# Altium schematic sheet USB_SPI.SchDoc: USB_SPI_V2
size A4; Date: 2019/08/25; CheckedBy: A Kadis; Author: DM Dong, YC Wang; CompanyName: CMMPE; Revision: B; SheetNumber: 2; SheetTotal: 4
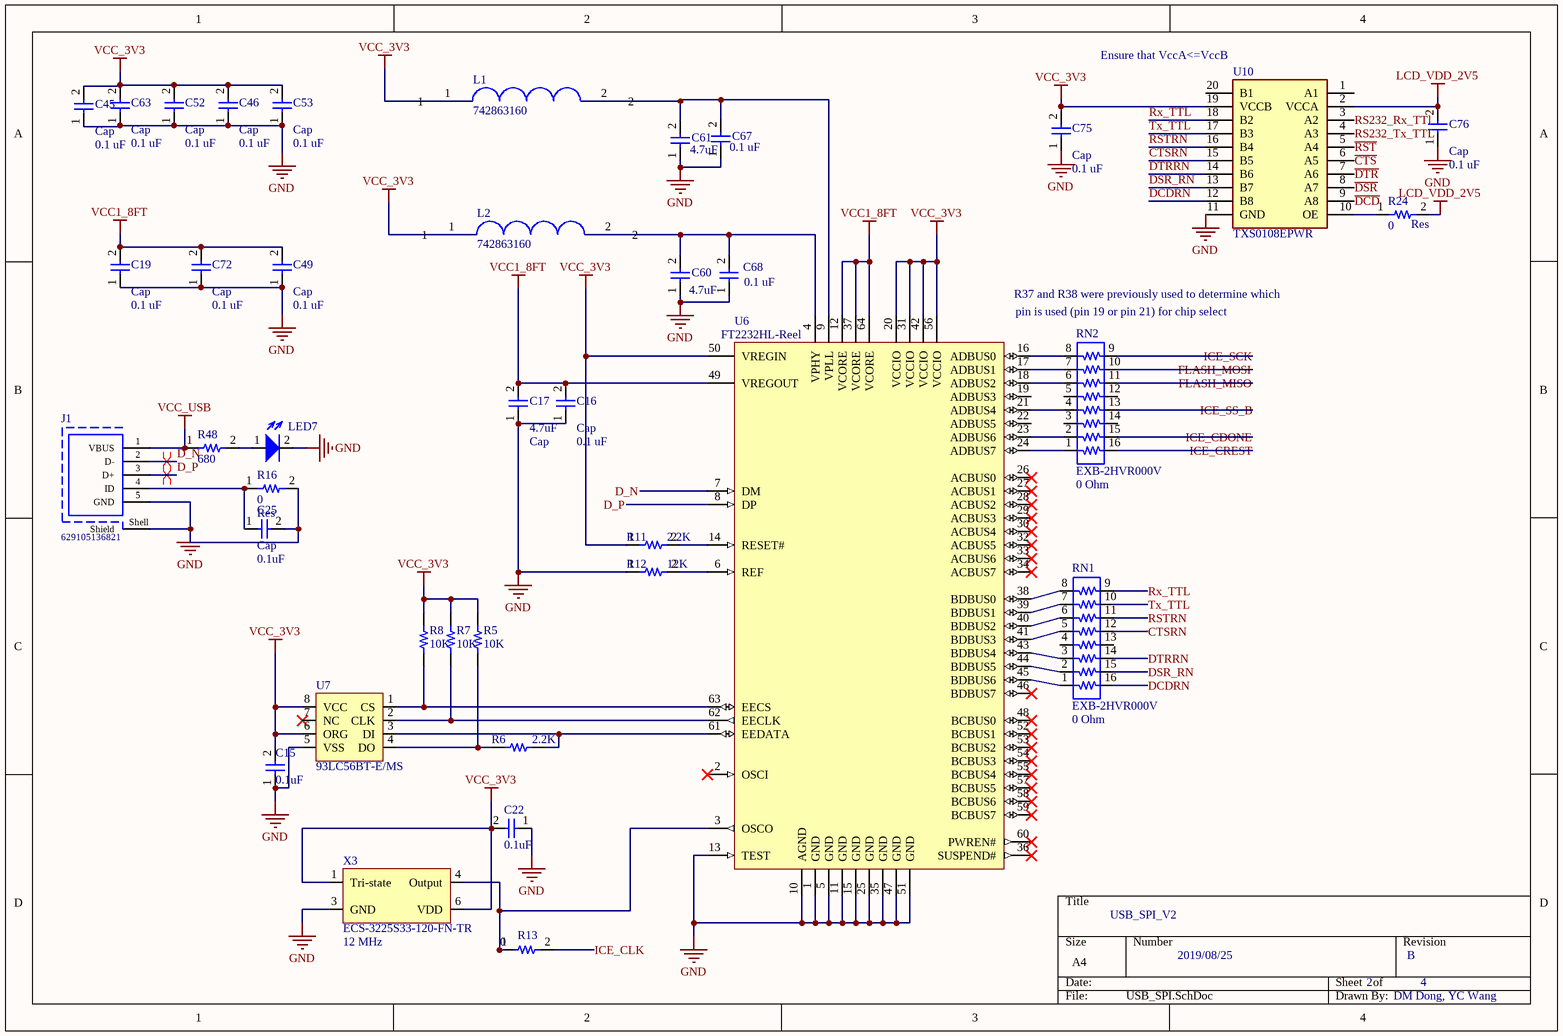
[diagram p0: USB_SPI.SchDoc]

## Parts
C15  value 0.1uF  [Cap_0.1uF]  (hidden comment: AC0603KRX7R9BB104)
C16  value 0.1 uF  Component Name: Cap  [Cap_0.1uF_0402]  (hidden comment: CC0402KPX5R6BB104)
C17  value 4.7uF  Component Name: Cap  [CAP_4.7uF_0402]  (hidden comment: C1005X5R0J475K050BC)
C19  value 0.1 uF  Component Name: Cap  [Cap_0.1uF_0402]  (hidden comment: CC0402KPX5R6BB104)
C22  value 0.1uF  [Cap_0.1uF]  (hidden comment: AC0603KRX7R9BB104)
C25  value 0.1uF  Component Name: Cap  [Cap_0.1uF]  (hidden comment: AC0603KRX7R9BB104)
C45  value 0.1 uF  Component Name: Cap  [Cap_0.1uF_0402]  (hidden comment: CC0402KPX5R6BB104)
C46  value 0.1 uF  Component Name: Cap  [Cap_0.1uF_0402]  (hidden comment: CC0402KPX5R6BB104)
C49  value 0.1 uF  Component Name: Cap  [Cap_0.1uF_0402]  (hidden comment: CC0402KPX5R6BB104)
C52  value 0.1 uF  Component Name: Cap  [Cap_0.1uF_0402]  (hidden comment: CC0402KPX5R6BB104)
C53  value 0.1 uF  Component Name: Cap  [Cap_0.1uF_0402]  (hidden comment: CC0402KPX5R6BB104)
C60  value 4.7uF  [CAP_4.7uF_0402]  (hidden comment: C1005X5R0J475K050BC)
C61  value 4.7uF  [CAP_4.7uF_0402]  (hidden comment: C1005X5R0J475K050BC)
C63  value 0.1 uF  Component Name: Cap  [Cap_0.1uF_0402]  (hidden comment: CC0402KPX5R6BB104)
C67  value 0.1 uF  [Cap_0.1uF_0402]  (hidden comment: CC0402KPX5R6BB104)
C68  value 0.1 uF  [Cap_0.1uF_0402]  (hidden comment: CC0402KPX5R6BB104)
C72  value 0.1 uF  Component Name: Cap  [Cap_0.1uF_0402]  (hidden comment: CC0402KPX5R6BB104)
C75  value 0.1 uF  Component Name: Cap  [Cap_0.1uF_0402]  (hidden comment: CC0402KPX5R6BB104)
C76  value 0.1 uF  Component Name: Cap  [Cap_0.1uF_0402]  (hidden comment: CC0402KPX5R6BB104)
J1  629105136821  [629105136821]
L1  742863160  [FerriteBeads]
L2  742863160  [FerriteBeads]
LED7  TLMS1000-GS08  [LED_RED]  (value not drawn)
R5  value 10K  [RES_10K]  (hidden comment: RT0603WRE0710KL)
R6  value 2.2K  [RES_2.2K]  (hidden comment: CRCW06032K20JNEAC)
R7  value 10K  [RES_10K]  (hidden comment: RT0603WRE0710KL)
R8  value 10K  [RES_10K]  (hidden comment: RT0603WRE0710KL)
R11  value 2.2K  [RES_2.2K]  (hidden comment: CRCW06032K20JNEAC)
R12  value 12K  [RES_12K]  (hidden comment: AC0603FR-1012KL)
R13  value 0  [RES_0]  (hidden comment: CRCW06030000Z0EAC)
R16  value 0  Component Name: Res  [RES_0]  (hidden comment: CRCW06030000Z0EAC)
R24  value 0  Component Name: Res  [RES_0]  (hidden comment: CRCW06030000Z0EAC)
R48  value 680  [RES_680]  (hidden comment: RT0603FRE13680RL)
RN1  EXB-2HVR000V  value 0 Ohm  [ResArray_0]
RN2  EXB-2HVR000V  value 0 Ohm  [ResArray_0]
U6  FT2232HL-Reel  [LQFP-64_N]
U7  93LC56BT-E/MS  [EEPROM]
U10  TXS0108EPWR  [SOP65P640X120-20N]
X3  ECS-3225S33-120-FN-TR  value 12 MHz  [12MHzOscillator]

## Nets
GND: C15.1 C16.1 C17.1 C19.1 C22.1 C25.2 C45.1 C46.1 C49.1 C52.1 C53.1 C60.1 C61.1 C63.1 C67.1 C68.1 C72.1 C75.1 C76.1 J1.5(GND) J1.Shell(Shield) LED7.2(Cathode) R12.1 R16.2 U6.1(GND) U6.5(GND) U6.10(AGND) U6.11(GND) U6.13(TEST) U6.15(GND) U6.25(GND) U6.35(GND) U6.47(GND) U6.51(GND) U7.5(VSS) U10.11(GND) X3.3(GND)
LCD_VDD_2V5: C76.2 R24.2 U10.2(VCCA)
VCC1_8FT: C16.2 C17.2 C19.2 C49.2 C72.2 U6.12(VCORE) U6.37(VCORE) U6.49(VREGOUT) U6.64(VCORE)
VCC_3V3: C15.2 C22.2 C45.2 C46.2 C52.2 C53.2 C63.2 C75.2 L1.1 L2.1 R5.2 R7.2 R8.2 R11.1 U6.20(VCCIO) U6.31(VCCIO) U6.42(VCCIO) U6.50(VREGIN) U6.56(VCCIO) U7.6(ORG) U7.8(VCC) U10.19(VCCB) X3.1(Tri-state) X3.6(VDD)
VCC_USB: J1.1(VBUS) R48.1
~{CTS}: U10.6(A5)
CTSRN: RN1.12 U10.15(B5)
~{DCD}: U10.9(A8)
~{DSR}: U10.8(A7)
~{DTR}: U10.7(A6)
D_N: J1.2(D-) U6.7(DM)
D_P: J1.3(D+) U6.8(DP)
DCDRN: RN1.16 U10.12(B8)
DSR_RN: RN1.15 U10.13(B7)
DTRRN: RN1.14 U10.14(B6)
FLASH_MISO: RN2.11
FLASH_MOSI: RN2.10
ICE_CDONE: RN2.15
ICE_CLK: R13.2
ICE_CREST: RN2.16
ICE_SCK: RN2.9
ICE_SS_B: RN2.13
~{RST}: U10.5(A4)
RS232_Rx_TTl: U10.3(A2)
RS232_Tx_TTL: U10.4(A3)
RSTRN: RN1.11 U10.16(B4)
Rx_TTL: RN1.9 U10.18(B2)
Tx_TTL: RN1.10 U10.17(B3)
NetC25_1: C25.1 J1.4(ID) R16.1
NetC60_2: C60.2 C68.2 L2.2 U6.4(VPHY)
NetC61_2: C61.2 C67.2 L1.2 U6.9(VPLL)
NetLED7_1: LED7.1(Anode) R48.2
NetR5_1: R5.1 R6.1 U7.4(DO)
NetR6_2: R6.2 U6.61(EEDATA) U7.3(DI)
NetR7_1: R7.1 U6.62(EECLK) U7.2(CLK)
NetR8_1: R8.1 U6.63(EECS) U7.1(CS)
NetR11_2: R11.2 U6.14(RESET#)
NetR12_2: R12.2 U6.6(REF)
NetR13_1: R13.1 U6.3(OSCO) X3.4(Output)
NetR24_1: R24.1 U10.10(OE)
NetRN1_1: RN1.1 U6.45(BDBUS6)
NetRN1_2: RN1.2 U6.44(BDBUS5)
NetRN1_3: RN1.3 U6.43(BDBUS4)
NetRN1_5: RN1.5 U6.41(BDBUS3)
NetRN1_6: RN1.6 U6.40(BDBUS2)
NetRN1_7: RN1.7 U6.39(BDBUS1)
NetRN1_8: RN1.8 U6.38(BDBUS0)
NetRN2_1: RN2.1 U6.24(ADBUS7)
NetRN2_2: RN2.2 U6.23(ADBUS6)
NetRN2_4: RN2.4 U6.21(ADBUS4)
NetRN2_6: RN2.6 U6.18(ADBUS2)
NetRN2_7: RN2.7 U6.17(ADBUS1)
NetRN2_8: RN2.8 U6.16(ADBUS0)

Not connected (* = marked no-connect by the designer): RN1 4 13; RN2 3 5 12 14; U6 2(OSCI)* 19(ADBUS3) 22(ADBUS5) 26(ACBUS0)* 27(ACBUS1)* 28(ACBUS2)* 29(ACBUS3)* 30(ACBUS4)* 32(ACBUS5)* 33(ACBUS6)* 34(ACBUS7)* 36(SUSPEND#)* 46(BDBUS7)* 48(BCBUS0)* 52(BCBUS1)* 53(BCBUS2)* 54(BCBUS3)* 55(BCBUS4)* 57(BCBUS5)* 58(BCBUS6)* 59(BCBUS7)* 60(PWREN#)*; U7 7(NC)*; U10 1(A1) 20(B1)

## Layout directives
differential pair; differential pair class Diff90: D_N, D_P

## Notes on the sheet
- (near U10) Ensure that VccA<=VccB
- R37 and R38 were previously used to determine which
- pin is used (pin 19 or pin 21) for chip select

## Library data of the parts
C15 C22 = Cap_0.1uF: Multilayer Ceramic Capacitors MLCC - SMD/SMT 0.1uF 10% 50V AEC-Q200; Component Name: Cap; Date Created: 01-Mar-2019; Created By: Daoming Dong; Datasheet URL: https://www.mouser.co.uk/datasheet/2/447/UPY-AC_NP0X7R_16V-to-630V_11-1511105.pdf; Package: 0603; Manufacture No.: AC0603KRX7R9BB104; Mouser No.: 603-AC0603KR9BB104
C16 C19 C45 C46 C49 C52 C53 C63 C72 C75 C76 = CAP_0.1uF_0402: Multilayer Ceramic Capacitors MLCC - SMD/SMT 100nF 10V X5R 10%; Manufacture: Yageo; Date Created: 11-Mar-2019; Created By: Daoming Dong; Manufacture No.: CC0402KPX5R6BB104; Mouser No.: 603-CC402KPX5R6BB104; Case Code: 0402; Datasheet URL.: https://www.mouser.co.uk/datasheet/2/447/UPY-GPHC_X5R_4V-to-50V_25-1131599.pdf
C17 = Cap_4.7uF_0402: Multilayer Ceramic Capacitors MLCC - SMD/SMT 0402 6.3V 4.7uF X5R 10% T: 0.5mm; Manufactue: TDK; Created By: Daoming Dong; Date Created: 13-Mar-2019; Mouser No.: 810-C1005X5R0J475K; Manufacture No.: C1005X5R0J475K050BC; Datasheet URL.: https://www.mouser.co.uk/datasheet/2/400/lcc_commercial_general_en-837201.pdf; Case Code: 0402
C25 = Cap_0.1uF: Multilayer Ceramic Capacitors MLCC - SMD/SMT 0.1uF 10% 50V AEC-Q200; Date Created: 01-Mar-2019; Created By: Daoming Dong; Datasheet URL: https://www.mouser.co.uk/datasheet/2/447/UPY-AC_NP0X7R_16V-to-630V_11-1511105.pdf; Package: 0603; Manufacture No.: AC0603KRX7R9BB104; Mouser No.: 603-AC0603KR9BB104
C60 C61 = Cap_4.7uF_0402: Multilayer Ceramic Capacitors MLCC - SMD/SMT 0402 6.3V 4.7uF X5R 10% T: 0.5mm; Manufactue: TDK; Component Name: Cap; Created By: Daoming Dong; Date Created: 13-Mar-2019; Mouser No.: 810-C1005X5R0J475K; Manufacture No.: C1005X5R0J475K050BC; Datasheet URL.: https://www.mouser.co.uk/datasheet/2/400/lcc_commercial_general_en-837201.pdf; Case Code: 0402
C67 C68 = CAP_0.1uF_0402: Multilayer Ceramic Capacitors MLCC - SMD/SMT 100nF 10V X5R 10%; Manufacture: Yageo; Component Name: Cap; Date Created: 11-Mar-2019; Created By: Daoming Dong; Manufacture No.: CC0402KPX5R6BB104; Mouser No.: 603-CC402KPX5R6BB104; Case Code: 0402; Datasheet URL.: https://www.mouser.co.uk/datasheet/2/447/UPY-GPHC_X5R_4V-to-50V_25-1131599.pdf
J1 = 629105136821: Micro USB 2.0 Type B Receptacle WR-COM, Horizontal, SMT, with Pads and Pegs; Rated Current: 1 A; Contact Resistance: 30 mOhm; Working Voltage: 30 VAC; ComponentLink1Description: Manufacturer; ComponentLink1URL: http://www.we-online.de; ComponentLink2Description: Datasheet; ComponentLink2URL: https://katalog.we-online.de/em/datasheet/629105136821.pdf; Part Number: 629105136821; Published Date: September 2018; Publisher: Wurth Elektronik; Orientation: Horizontal; Connector Type: Micro USB 2.0 Type B; Operating Temperature: -40 to 105 degC; Mounting Technology: SMT; Gender: Receptacle; Packaging: Tape and Reel
L1 L2 = Ferrite Bead: Ferrite Bead, 0603 [1608 Metric], 600 ohm, 500 mA, WE-CBF HF Series, 0.35 ohm, ± 25%; Manufacture: Wurth Electronics; Case Code: 0603; Component Name: Ferrite Bead; Created By: Youchao Wang; Datasheet URL: https://www.mouser.co.uk/datasheet/2/445/742863160-538931.pdf; Date Created: 22-Mar-2019; Manufacture No.: 742863160; Mouser No.: 710-742863160
LED7 = LED_RED: Standard LEDs - SMD RED; Component Name: LED_R; Vf: 1.8V; Created By: Daoming Dong; Date Created: 11-Mar-2018; Manufacture No.: TLMS1000-GS08; Mouser No.: 78-TLMS1000; Case Code: 0603; Datasheet URL.: https://www.mouser.co.uk/datasheet/2/427/tlmb1100-279843.pdf
R5 R7 R8 = Res_10K: Thin Film Resistors - SMD 10K ohm 0.05% 50 ppm High-Precision; Manufacture: Yageo; Component Name: Res; Manufacture No.: RT0603WRE0710KL; Mouser No.: 603-RT0603WRE0710KL; Created By: Daoming Dong; Date Created: 02-Mar-2019; Datasheet URL.: https://www.mouser.co.uk/datasheet/2/447/PYu-RT_1-to-0.01_RoHS_L_9-1222720.pdf; Case Code: 0603
R6 R11 = Res_2.2K: Thick Film Resistors - SMD 1/10Watt 2.2Kohms 5% Commercial Use; Manufacture: Vishay; Component Name: Res; Manufacture No.: CRCW06032K20JNEAC; Mouser No.: 71-CRCW06032K20JNEAC; Created By: Daoming Dong; Date Created: 02-Mar-2019; Case Code: 0603; Datasheet URL.: https://www.mouser.co.uk/datasheet/2/427/crcwce3-1223726.pdf
R12 = Res_12K: Thick Film Resistors - SMD 12K ohm 1% 1/10W AEC-Q200; Manufacture: Yageo; Component Name: Res; Created By: Daoming Dong; Date Created: 02-Mar-2019; Manufacture No.: AC0603FR-1012KL; Mouser No.: 603-AC0603FR-1012KL; Case Code: 0603; Datasheet URL.: https://www.mouser.co.uk/datasheet/2/447/PYu-AC_51_RoHS_L_6-1152827.pdf
R13 = Res_0: Thick Film Resistors - SMD 1/10Watt 0ohms Commercial Use; Manufacture: Vishay; Component Name: Res; Case Code: 0603; Manufacture No.: CRCW06030000Z0EAC; Mouser No.: 71-CRCW06030000Z0EAC; Created By: Daoming Dong; Date Created: 02-Mar-2019; Datasheet URL.: https://www.mouser.co.uk/datasheet/2/427/crcwce3-1223726.pdf
R16 R24 = Res_0: Thick Film Resistors - SMD 1/10Watt 0ohms Commercial Use; Manufacture: Vishay; Case Code: 0603; Manufacture No.: CRCW06030000Z0EAC; Mouser No.: 71-CRCW06030000Z0EAC; Created By: Daoming Dong; Date Created: 02-Mar-2019; Datasheet URL.: https://www.mouser.co.uk/datasheet/2/427/crcwce3-1223726.pdf
R48 = Res_680: Thin Film Resistors - SMD 680 ohm 1% 50 ppm Thin Film; Manufacture: Yageo; Component Name: Res; Manufacture No.: RT0603FRE13680RL; Mouser No.: 603-RT0603FRE13680RL; Created By: Daoming Dong; Date Created: 02-Mar-2019; Datasheet URL.: https://www.mouser.co.uk/datasheet/2/447/PYu-RT_1-to-0.01_RoHS_L_9-1222720.pdf; Case Code: 0603
RN1 RN2 = ResArray_0: Resistor Networks & Arrays 0402 Zero ohm Jumper Convex Term AEC-Q200; Manufacture: Panasonic; Manufacture No.: EXB-2HVR000V; Mouser No.: 667-EXB-2HVR000V; Case Code: 0402; Date Created: 11-Mar-2019; Created By: Daoming Dong; Datasheet URL.: https://www.mouser.co.uk/datasheet/2/315/AOC0000C14-1108062.pdf
U6 = FT2232HL-Reel: Dual High Speed USB To Multipurpose UART/FIFO IC, 64-pin LQFP, Tape and Reel; Manufacturer: FTDI; DatasheetVersion: ver 2.21, Jun-2012; PackageVersion: Jun-12; PackageReference: LQFP-64; PackageDescription: 64-Pin Thin Quad Flat Pack, 10 x 10 x 1.4 mm Body, 0.5 mm Pitch; PartNumber: FT2232HL-Reel; ComponentLink1Description: Manufacturer URL; ComponentLink1URL: http://www.ftdichip.com/; ComponentLink2Description: Datasheet; ComponentLink2URL: http://www.ftdichip.com/Support/Documents/DataSheets/ICs/DS_FT2232H.pdf
U7 = EEPROM: EEPROM 128x16 for FT2232; Manufacture: Microchip; Created By: Daoming Dong; Date Crated: 11-Mar-2019; Organisation: 128x16; Package: MSOP-8; Mouser No.: 579-93LC56BT-E/MS; Manufactur No.: 93LC56BT-E/MS
U10 = Level_Shfter_8bits: Integrated Circuit; Manufacturer_Name: Texas Instruments; Datasheet Link: http://www.ti.com/lit/ds/symlink/txs0108e.pdf; Height: 1.2mm; Mouser Part Number: 595-TXS0108EPWR; Mouser Price/Stock: https://www.mouser.com/Search/Refine.aspx?Keyword=595-TXS0108EPWR; Manufacturer_Part_Number: TXS0108EPWR
X3 = 12MHzOscillator: Standard Clock Oscillators 12MHz 3.3V 10ppm -40C +85C; Component Name: 12 MHz Crystal Oscillators; Manufacture No.: ECS-3225S33-120-FN-TR; Mouser No.: 520-3225S33-120-FNT; Date Created: 12-Mar-2019; Datasheet URL.: https://www.mouser.co.uk/datasheet/2/122/ECS-3225S-1064150.pdf; Frequency Stability: 10 PPM